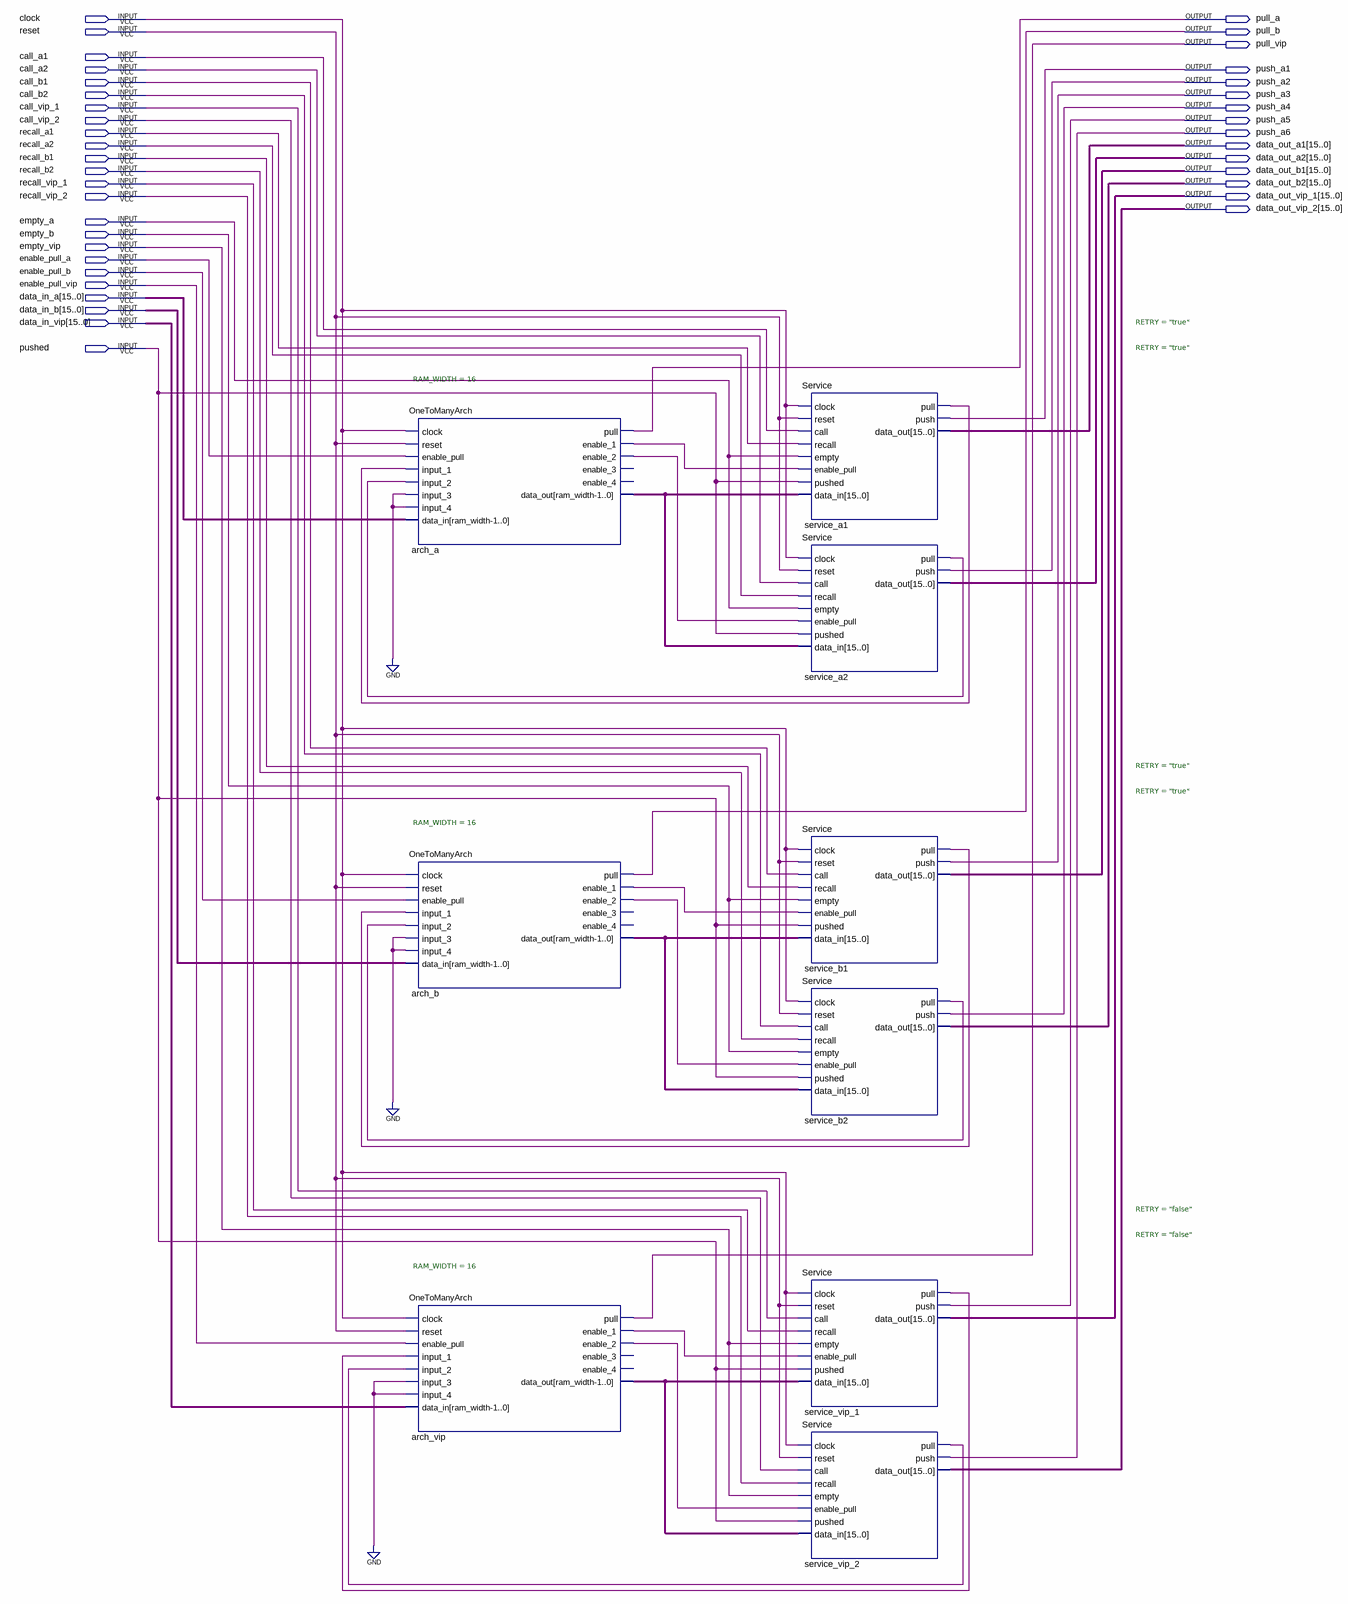
[diagram p0: schematic sheet]
// Quartus schematic MultiServices.bdf as structural Verilog: 9 symbols, 39 pins
module MultiServices (
  input  clock,
  input  reset,
  input  call_a1,
  input  call_a2,
  input  call_b1,
  input  call_b2,
  input  call_vip_1,
  input  call_vip_2,
  input  recall_a1,
  input  recall_a2,
  input  recall_b1,
  input  recall_b2,
  input  recall_vip_1,
  input  recall_vip_2,
  input  empty_a,
  input  empty_b,
  input  empty_vip,
  input  enable_pull_a,
  input  enable_pull_b,
  input  enable_pull_vip,
  input  [15:0] data_in_a,
  input  [15:0] data_in_b,
  input  [15:0] data_in_vip,
  input  pushed,
  output pull_a,
  output pull_b,
  output pull_vip,
  output push_a1,
  output push_a2,
  output push_a3,
  output push_a4,
  output push_a5,
  output push_a6,
  output [15:0] data_out_a1,
  output [15:0] data_out_a2,
  output [15:0] data_out_b1,
  output [15:0] data_out_b2,
  output [15:0] data_out_vip_1,
  output [15:0] data_out_vip_2
);

  wire arch_a_enable_1, arch_a_enable_2, arch_b_enable_1, arch_b_enable_2, arch_vip_enable_1,
       arch_vip_enable_2, service_a1_pull, service_a2_pull, service_b1_pull, service_b2_pull,
       service_vip_1_pull, service_vip_2_pull;
  wire [15:0] arch_a_data_out, arch_b_data_out, arch_vip_data_out;

  OneToManyArch #(.RAM_WIDTH(16)) arch_a (
    .clock(clock), .reset(reset), .enable_pull(enable_pull_a), .input_1(service_a1_pull),
    .input_2(service_a2_pull), .input_3(1'b0), .input_4(1'b0), .data_in(data_in_a), .pull(pull_a),
    .enable_1(arch_a_enable_1), .enable_2(arch_a_enable_2), .data_out(arch_a_data_out));  // open: enable_3, enable_4
  OneToManyArch #(.RAM_WIDTH(16)) arch_b (
    .clock(clock), .reset(reset), .enable_pull(enable_pull_b), .input_1(service_b1_pull),
    .input_2(service_b2_pull), .input_3(1'b0), .input_4(1'b0), .data_in(data_in_b), .pull(pull_b),
    .enable_1(arch_b_enable_1), .enable_2(arch_b_enable_2), .data_out(arch_b_data_out));  // open: enable_3, enable_4
  OneToManyArch #(.RAM_WIDTH(16)) arch_vip (
    .clock(clock), .reset(reset), .enable_pull(enable_pull_vip), .input_1(service_vip_1_pull),
    .input_2(service_vip_2_pull), .input_3(1'b0), .input_4(1'b0), .data_in(data_in_vip), .pull(pull_vip),
    .enable_1(arch_vip_enable_1), .enable_2(arch_vip_enable_2), .data_out(arch_vip_data_out));  // open: enable_3, enable_4
  Service #(.RETRY("true")) service_a1 (
    .clock(clock), .reset(reset), .call(call_a1), .recall(recall_a1), .empty(empty_a),
    .enable_pull(arch_a_enable_1), .pushed(pushed), .data_in(arch_a_data_out), .pull(service_a1_pull),
    .push(push_a1), .data_out(data_out_a1));
  Service #(.RETRY("true")) service_a2 (
    .clock(clock), .reset(reset), .call(call_a2), .recall(recall_a2), .empty(empty_a),
    .enable_pull(arch_a_enable_2), .pushed(pushed), .data_in(arch_a_data_out), .pull(service_a2_pull),
    .push(push_a2), .data_out(data_out_a2));
  Service #(.RETRY("true")) service_b1 (
    .clock(clock), .reset(reset), .call(call_b1), .recall(recall_b1), .empty(empty_b),
    .enable_pull(arch_b_enable_1), .pushed(pushed), .data_in(arch_b_data_out), .pull(service_b1_pull),
    .push(push_a3), .data_out(data_out_b1));
  Service #(.RETRY("true")) service_b2 (
    .clock(clock), .reset(reset), .call(call_b2), .recall(recall_b2), .empty(empty_b),
    .enable_pull(arch_b_enable_2), .pushed(pushed), .data_in(arch_b_data_out), .pull(service_b2_pull),
    .push(push_a4), .data_out(data_out_b2));
  Service #(.RETRY("false")) service_vip_1 (
    .clock(clock), .reset(reset), .call(call_vip_1), .recall(recall_vip_1), .empty(empty_vip),
    .enable_pull(arch_vip_enable_1), .pushed(pushed), .data_in(arch_vip_data_out), .pull(service_vip_1_pull),
    .push(push_a5), .data_out(data_out_vip_1));
  Service #(.RETRY("false")) service_vip_2 (
    .clock(clock), .reset(reset), .call(call_vip_2), .recall(recall_vip_2), .empty(empty_vip),
    .enable_pull(arch_vip_enable_2), .pushed(pushed), .data_in(arch_vip_data_out), .pull(service_vip_2_pull),
    .push(push_a6), .data_out(data_out_vip_2));
endmodule
